# Altium schematic sheet mcuB.SCHDOC: LiveDesign Evaluation - Video Games
size A; Organization: Altium Limited; Address1: L3, 12a Rodborough Rd; Address2: Frenchs Forest; Address3: NSW; Address4: Australia 2086; DocumentNumber: 10; SheetNumber: 10; SheetTotal: 11
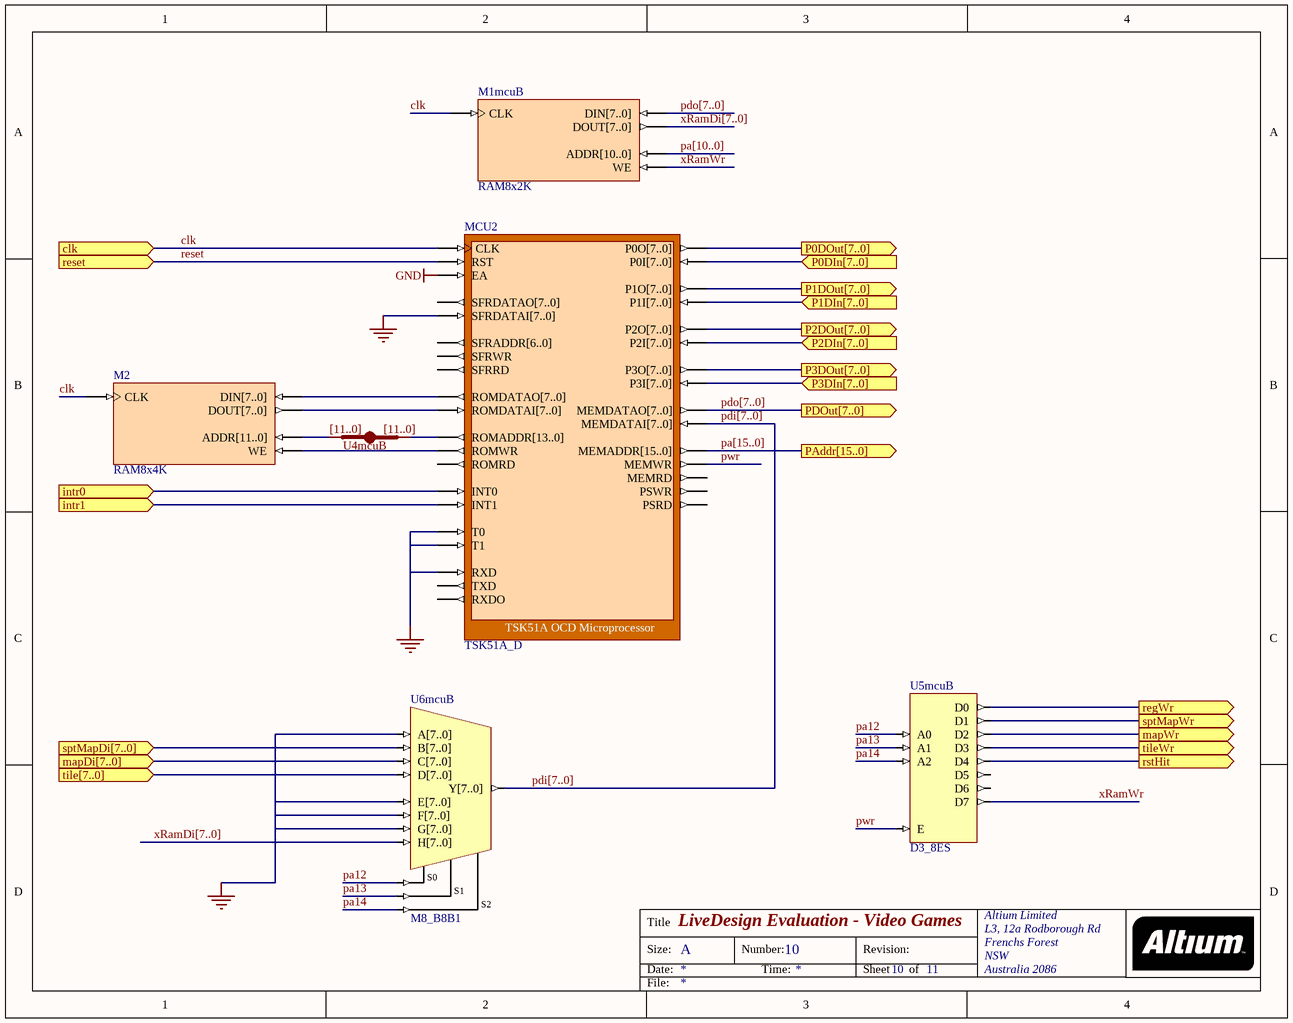
[diagram p0: mcuB.SCHDOC]

## Parts
M1mcuB  RAM8x2K
M2  RAM8x4K
MCU2  TSK51A_D
U4mcuB  IndexA: [11..0]  (hidden comment: JB)
U5mcuB  D3_8ES
U6mcuB  M8_B8B1

## Ports
clk (in), intr0 (in), intr1 (in), mapDi[7..0] (in), mapWr (out), P0DIn[7..0] (in), P0DOut[7..0] (out), P1DIn[7..0] (in), P1DOut[7..0] (out), P2DIn[7..0] (in), P2DOut[7..0] (out), P3DIn[7..0] (in), P3DOut[7..0] (out), PAddr[15..0] (out), PDOut[7..0] (out), regWr (out), reset (in), rstHit (out), sptMapDi[7..0] (in), sptMapWr (out), tile[7..0] (in), tileWr (out)

## Nets
GND: MCU2.EA MCU2.RXD MCU2.T0 MCU2.T1
GNDBUS[..]: MCU2.SFRDATAI[7..0] U6mcuB.A[7..0] U6mcuB.E[7..0] U6mcuB.F[7..0] U6mcuB.G[7..0]
clk: M1mcuB.CLK M2.CLK MCU2.CLK ; port clk
intr0: MCU2.INT0 ; port intr0
intr1: MCU2.INT1 ; port intr1
mapDi[7..0]: U6mcuB.C[7..0] ; port mapDi[7..0]
mapWr: U5mcuB.D2 ; port mapWr
P0DIn[7..0]: MCU2.P0I[7..0] ; port P0DIn[7..0]
P0DOut[7..0]: MCU2.P0O[7..0] ; port P0DOut[7..0]
P1DIn[7..0]: MCU2.P1I[7..0] ; port P1DIn[7..0]
P1DOut[7..0]: MCU2.P1O[7..0] ; port P1DOut[7..0]
P2DIn[7..0]: MCU2.P2I[7..0] ; port P2DIn[7..0]
P2DOut[7..0]: MCU2.P2O[7..0] ; port P2DOut[7..0]
P3DIn[7..0]: MCU2.P3I[7..0] ; port P3DIn[7..0]
P3DOut[7..0]: MCU2.P3O[7..0] ; port P3DOut[7..0]
pa12: U5mcuB.A0 U6mcuB.S0
pa13: U5mcuB.A1 U6mcuB.S1
pa14: U5mcuB.A2 U6mcuB.S2
pa[10..0]: M1mcuB.ADDR[10..0]
pa[15..0]: MCU2.MEMADDR[15..0] ; port PAddr[15..0]
pdi[7..0]: MCU2.MEMDATAI[7..0] U6mcuB.Y[7..0]
pdo[7..0]: M1mcuB.DIN[7..0] MCU2.MEMDATAO[7..0] ; port PDOut[7..0]
pwr: MCU2.MEMWR U5mcuB.E
regWr: U5mcuB.D0 ; port regWr
reset: MCU2.RST ; port reset
rstHit: U5mcuB.D4 ; port rstHit
sptMapDi[7..0]: U6mcuB.B[7..0] ; port sptMapDi[7..0]
sptMapWr: U5mcuB.D1 ; port sptMapWr
tile[7..0]: U6mcuB.D[7..0] ; port tile[7..0]
tileWr: U5mcuB.D3 ; port tileWr
xRamDi[7..0]: M1mcuB.DOUT[7..0] U6mcuB.H[7..0]
xRamWr: M1mcuB.WE U5mcuB.D7
NetM2_ADDR[11..0]: M2.ADDR[11..0] U4mcuB.A[0..0]
NetM2_DIN[7..0]: M2.DIN[7..0] MCU2.ROMDATAO[7..0]
NetM2_DOUT[7..0]: M2.DOUT[7..0] MCU2.ROMDATAI[7..0]
NetM2_WE: M2.WE MCU2.ROMWR
NetMCU2_ROMADDR[13..0]: MCU2.ROMADDR[13..0] U4mcuB.B[0..0]

Not connected (* = marked no-connect by the designer): MCU2 MEMRD PSRD PSWR ROMRD RXDO SFRADDR[6..0] SFRDATAO[7..0] SFRRD SFRWR TXD; U5mcuB D5 D6

## Buses and harness runs
bus pa[10..0]
bus pa[15..0] = port PAddr[15..0]
bus pdi[7..0]
bus pdo[7..0]
bus pdo[7..0] = port PDOut[7..0]
bus xRamDi[7..0]

## Notes on the sheet
- Labels drawn without touching a wire or pin: GNDBUS[..]
- Title
- Size:
- Date:
- A
- Number:
- Time:
- Revision:
- Sheet
- of
- File:

## Library data of the parts
M1mcuB = RAM8x2K: Single Port Random Access Memory 2048 x 8; Memory_Depth: 2048; Memory_Type: RAM_SinglePortBlock; Memory_Width: 8; Memory_ClockEdge: Rising; Nexus_Core: Memory_Program; Published: 26/09/2003; Publisher: Altium Hobart Technology Center
M2 = RAM8x4K: Single Port Random Access Memory 4096 x 8; Memory_Depth: 4096; Memory_Type: RAM_SinglePortBlock; Memory_Width: 8; Memory_ClockEdge: Rising; Nexus_Core: Memory_Program; Published: 26/09/2003; Publisher: Altium Hobart Technology Center
MCU2 = TSK51A_D: TSK51A OCD Microprocessor; NEXUS_CORE: Processor_OCDS; NEXUS_JTAG_DEVICE: True; NEXUS_JTAG_ORDER: 0; ChildModel1: RAM256x8_TSK51D; ChildCore1: M2; Memory_Configuration: Record[NEXUS_CORE]{}ComponentDesignator[iram]{}Memory_Depth[256]{}Memory_UsageType[ram]{}ProgramDownloadAddress[0x0]{}Memory_BusType[c51:idata_bus]{n}Record[NEXUS_CORE]{}ComponentDesignator[xram]{}Memory_Depth[2k]{}Memory_UsageType[ram]{}ProgramDownloadAddress[0x7000]{}Memory_BusType[c51:xdata_bus]{n}Record[NEXUS_CORE]{}ComponentDesignator[xrom]{}Memory_Depth[4k]{}Memory_UsageType[rom]{}ProgramDownloadAddress[0x0]{}Memory_BusType[c51:code_bus]{n}; Published: 23/10/2003; Publisher: Altium Hobart Technology Centre; Core Revision: 1.00.00
U4mcuB = JB: System BUS Joiner; ArchiveName: GENERIC; Published: 18-Dec-2003; Publisher: Altium Limited; Core Revision: 1.00.00; IndexB: [11..0]
U5mcuB = D3_8ES: Binary 3- to 8-Bit Decoder with Enable, Single Pin Version; Xilinx Equivalent: D3_8E; ArchiveName: GENERIC; Published: 9-30-2003; Publisher: Altium Limited; Core Revision: 1.00.00
U6mcuB = M8_B8B1: 8x8-Bit Bus to 1x8-Bit Bus Multiplexer; ArchiveName: GENERIC; Published: 9-30-2003; Publisher: Altium Limited; Core Revision: 1.00.00